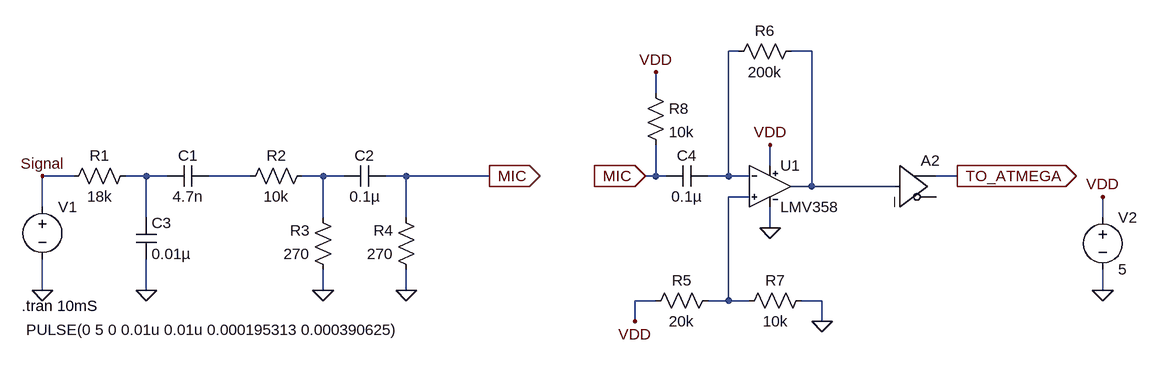
[diagram p0: schematic mic-in_simulation_3.asc]
mic-in_simulation_3.asc, the LTspice schematic file:
Version 4
SHEET 1 2012 680
WIRE 896 -432 880 -432
WIRE 1008 -432 976 -432
WIRE 768 -368 768 -400
WIRE 944 -256 944 -288
WIRE -128 -240 -176 -240
WIRE -16 -240 -48 -240
WIRE 16 -240 -16 -240
WIRE 144 -240 80 -240
WIRE 256 -240 224 -240
WIRE 288 -240 256 -240
WIRE 384 -240 352 -240
WIRE 512 -240 384 -240
WIRE 768 -240 768 -288
WIRE 768 -240 752 -240
WIRE 784 -240 768 -240
WIRE 880 -240 880 -432
WIRE 880 -240 848 -240
WIRE 912 -240 880 -240
WIRE 1232 -240 1200 -240
WIRE 1008 -224 1008 -432
WIRE 1008 -224 976 -224
WIRE 1136 -224 1008 -224
WIRE 912 -208 880 -208
WIRE -176 -192 -176 -240
WIRE -16 -176 -16 -240
WIRE 256 -176 256 -240
WIRE 384 -176 384 -240
WIRE 1456 -176 1456 -208
WIRE 944 -160 944 -192
WIRE -176 -64 -176 -112
WIRE -16 -64 -16 -112
WIRE 256 -64 256 -96
WIRE 384 -64 384 -96
WIRE 1456 -64 1456 -96
WIRE 768 -48 736 -48
WIRE 880 -48 880 -208
WIRE 880 -48 848 -48
WIRE 912 -48 880 -48
WIRE 1024 -48 992 -48
WIRE 736 -16 736 -48
WIRE 1024 -16 1024 -48
FLAG -176 -64 0
FLAG 256 -64 0
FLAG 384 -64 0
FLAG -16 -64 0
FLAG 512 -240 MIC
IOPIN 512 -240 Out
FLAG 752 -240 MIC
IOPIN 752 -240 In
FLAG 1232 -240 TO_ATMEGA
IOPIN 1232 -240 Out
FLAG -176 -240 Signal
FLAG 1456 -64 0
FLAG 1456 -208 VDD
FLAG 944 -288 VDD
FLAG 944 -160 0
FLAG 736 -16 VDD
FLAG 1024 -16 0
FLAG 768 -400 VDD
SYMBOL voltage -176 -208 R0
WINDOW 123 0 0 Left 2
WINDOW 39 0 0 Left 2
WINDOW 3 -25 205 Left 2
SYMATTR Value PULSE(0 5 0 0.01u 0.01u 0.000195313 0.000390625)
SYMATTR InstName V1
SYMBOL res -32 -256 R90
WINDOW 0 0 56 VBottom 2
WINDOW 3 32 56 VTop 2
SYMATTR InstName R1
SYMATTR Value 18k
SYMBOL res 240 -256 R90
WINDOW 0 0 56 VBottom 2
WINDOW 3 32 56 VTop 2
SYMATTR InstName R2
SYMATTR Value 10k
SYMBOL res 272 -80 R180
WINDOW 0 36 76 Left 2
WINDOW 3 36 40 Left 2
SYMATTR InstName R3
SYMATTR Value 270
SYMBOL res 400 -80 R180
WINDOW 0 36 76 Left 2
WINDOW 3 36 40 Left 2
SYMATTR InstName R4
SYMATTR Value 270
SYMBOL cap 80 -256 R90
WINDOW 0 0 32 VBottom 2
WINDOW 3 32 32 VTop 2
SYMATTR InstName C1
SYMATTR Value 4.7n
SYMBOL cap 352 -256 R90
WINDOW 0 0 32 VBottom 2
WINDOW 3 32 32 VTop 2
SYMATTR InstName C2
SYMATTR Value 0.1µ
SYMBOL cap -32 -176 R0
SYMATTR InstName C3
SYMATTR Value 0.01µ
SYMBOL voltage 1456 -192 R0
WINDOW 123 0 0 Left 2
WINDOW 39 0 0 Left 2
SYMATTR InstName V2
SYMATTR Value 5
SYMBOL Digital\\buf 1136 -288 R0
SYMATTR InstName A2
SYMATTR Value2 Vhigh=5 Vlow=0 Ref=1.5
SYMBOL LMV358 944 -288 R0
SYMATTR InstName U1
SYMBOL res 992 -448 R90
WINDOW 0 0 56 VBottom 2
WINDOW 3 32 56 VTop 2
SYMATTR InstName R6
SYMATTR Value 200k
SYMBOL cap 848 -256 R90
WINDOW 0 0 32 VBottom 2
WINDOW 3 32 32 VTop 2
SYMATTR InstName C4
SYMATTR Value 0.1µ
SYMBOL res 864 -64 R90
WINDOW 0 0 56 VBottom 2
WINDOW 3 32 56 VTop 2
SYMATTR InstName R5
SYMATTR Value 20k
SYMBOL res 1008 -64 R90
WINDOW 0 0 56 VBottom 2
WINDOW 3 32 56 VTop 2
SYMATTR InstName R7
SYMATTR Value 10k
SYMBOL res 752 -384 R0
SYMATTR InstName R8
SYMATTR Value 10k
TEXT -208 -40 Left 2 !.tran 10mS

The netlist it stands for:
* mic-in_simulation_3.asc
V1 Signal 0 PULSE(0 5 0 0.01u 0.01u 0.000195313 0.000390625)
R1 N003 Signal 18k
R2 N005 N004 10k
R3 0 N005 270
R4 0 MIC 270
C1 N004 N003 4.7n
C2 MIC N005 0.1µ
C3 N003 0 0.01µ
V2 VDD 0 5
A2 N002 0 0 0 0 0 TO_ATMEGA 0 BUF Vhigh=5 Vlow=0 Ref=1.5
XU1 N006 N001 VDD 0 N002 LMV358  ; pins In+ In- V+ V- OUT
R6 N002 N001 200k
C4 N001 MIC 0.1µ
R5 N006 VDD 20k
R7 0 N006 10k
R8 VDD MIC 10k
.tran 10mS
.lib LMV358.sub
.backanno
.end